# Altium schematic sheet ESP8266EX.SchDoc
size A4
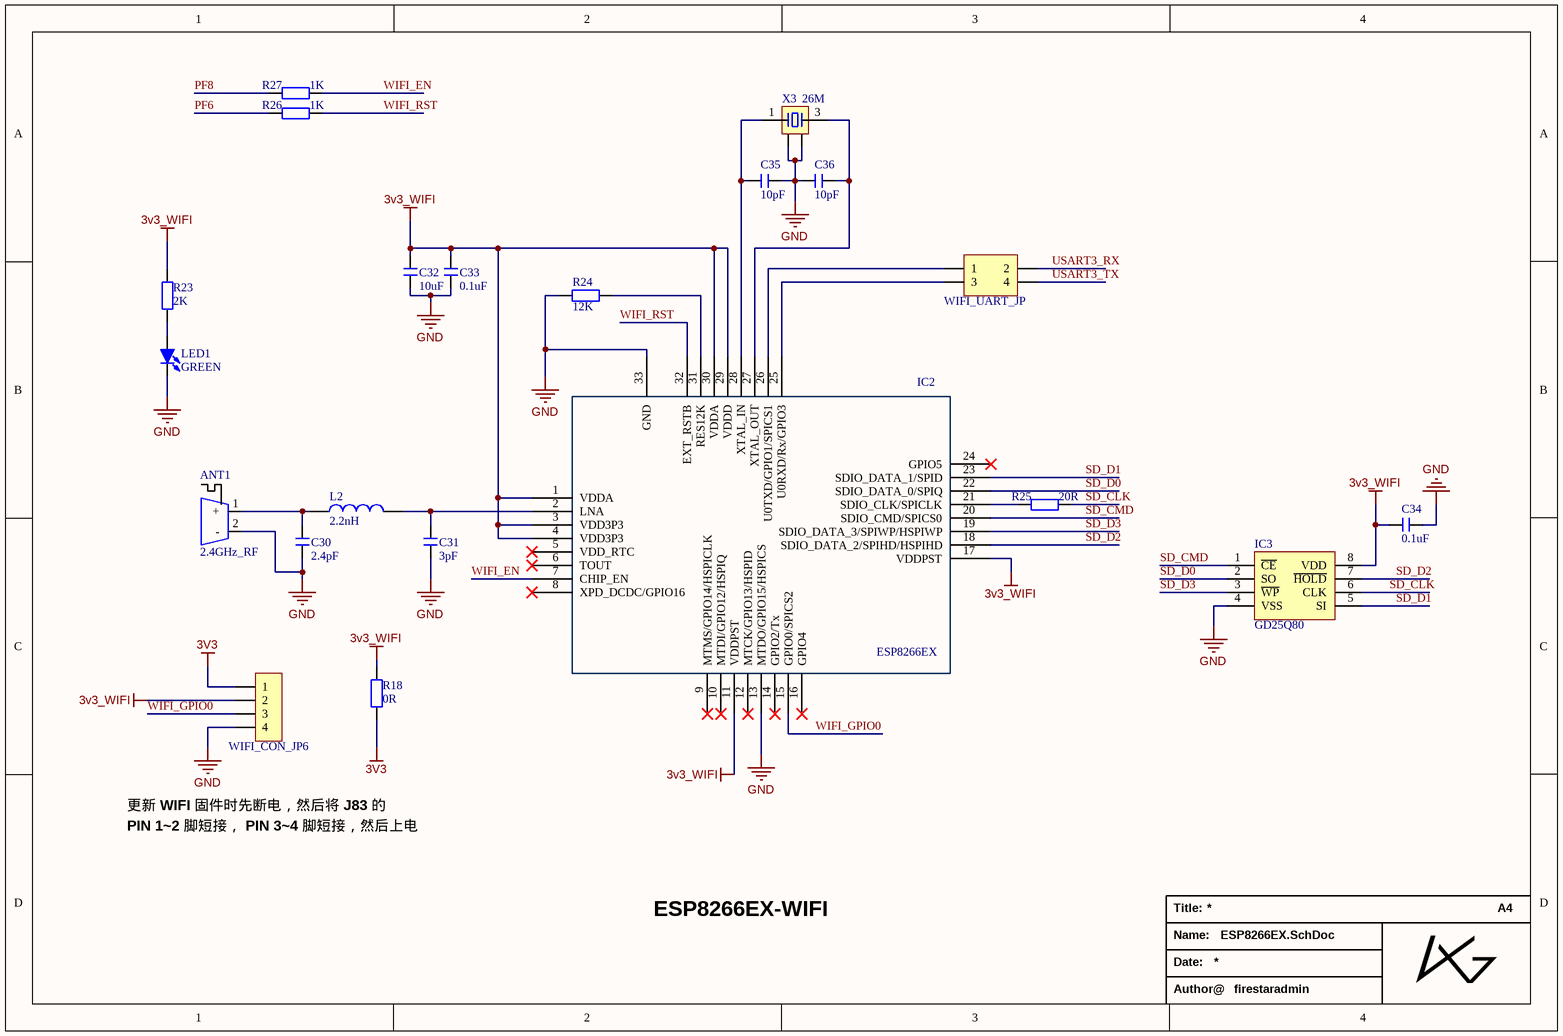
[diagram p0: ESP8266EX.SchDoc]

## Parts
ANT1  2.4GHz_RF  [ANT-F-1-2.4G]
C30  2.4pF  [C 0603_M]
C31  3pF  [C 0603_M]
C32  10uF  [C 0603_M]
C33  0.1uF  [C 0603_M]
C34  0.1uF  [C 0603_M]
C35  10pF  [C 0603_M]
C36  10pF  [C 0603_M]
IC2  ESP8266EX  [QFN32 5x5_L]
IC3  GD25Q80  [SOP8W_N]
L2  2.2nH  [L 0603]
LED1  GREEN  [LED 0603G]
R18  0R  [R 0603_M]
R23  2K  [R 0603_M]
R24  12K  [R 0603_M]
R25  20R  [R 0603_M]
R26  1K  [R 0603_M]
R27  1K  [R 0603_M]
WIFI_CON_JP6  HDR-1X4  [HDR2.54-LI-4P]  (value not drawn)
WIFI_UART_JP  Header2X2  [HDR2.54-LI-2x2P]  (value not drawn)
X3  26M  [OSC 3225-4P]

## Nets
3V3: R18.1 WIFI_CON_JP6.1
3v3_WIFI: C32.1 C33.1 C34.1 IC2.1(VDDA) IC2.3(VDD3P3) IC2.4(VDD3P3) IC2.11(VDDPST) IC2.17(VDDPST) IC2.29(VDDD) IC2.30(VDDA) IC3.8(VDD) R18.2 R23.2 WIFI_CON_JP6.2
GND: ANT1.2(-) C30.2 C31.2 C32.2 C33.2 C34.2 C35.1 C36.2 IC2.13(MTDO/GPIO15/HSPICS) IC2.33(GND) IC3.4(VSS) LED1.2(K) R24.2 WIFI_CON_JP6.4 X3.2 X3.4
PF6: R26.2
PF8: R27.2
SD_CLK: IC3.6(CLK) R25.1
SD_CMD: IC2.20(SDIO_CMD/SPICS0) IC3.1(~{CE})
SD_D0: IC2.22(SDIO_DATA_0/SPIQ) IC3.2(SO)
SD_D1: IC2.23(SDIO_DATA_1/SPID) IC3.5(SI)
SD_D2: IC2.18(SDIO_DATA_2/SPIHD/HSPIHD) IC3.7(~{HOLD})
SD_D3: IC2.19(SDIO_DATA_3/SPIWP/HSPIWP) IC3.3(~{WP})
USART3_RX: WIFI_UART_JP.2
USART3_TX: WIFI_UART_JP.4
WIFI_EN: IC2.7(CHIP_EN) R27.1
WIFI_GPIO0: IC2.15(GPIO0/SPICS2) WIFI_CON_JP6.3
WIFI_RST: IC2.32(EXT_RSTB) R26.1
NetANT1_1: ANT1.1(+) C30.1 L2.1
NetC31_1: C31.1 IC2.2(LNA) L2.2
NetC35_2: C35.2 IC2.28(XTAL_IN) X3.1
NetC36_1: C36.1 IC2.27(XTAL_OUT) X3.3
NetIC2_21: IC2.21(SDIO_CLK/SPICLK) R25.2
NetIC2_25: IC2.25(U0RXD/Rx/GPIO3) WIFI_UART_JP.3
NetIC2_26: IC2.26(U0TXD/GPIO1/SPICS1) WIFI_UART_JP.1
NetIC2_31: IC2.31(RES12K) R24.1
NetLED1_1: LED1.1(A) R23.1

Not connected (* = marked no-connect by the designer): IC2 5(VDD_RTC)* 6(TOUT)* 8(XPD_DCDC/GPIO16)* 9(MTMS/GPIO14/HSPICLK)* 10(MTDI/GPIO12/HSPIQ)* 12(MTCK/GPIO13/HSPID)* 14(GPIO2/Tx)* 16(GPIO4)* 24(GPIO5)*

## Notes on the sheet
- 更新 WIFI 固件时先断电，然后将 J83 的
- PIN 1~2 脚短接， PIN 3~4 脚短接，然后上电
- ESP8266EX-WIFI
- Title:
- A4
- Name:
- Date:
- Author@
- firestaradmin

## Library data of the parts
C30-C36 = C: 无极性贴片电容; 版权归属: 源创客; BOM名称: 无极性贴片电容; 学习资源: www.ooocke.com
IC2 = ESP8266EX: WIFI-芯片; 版权归属: 源创客; BOM名称: WIFI-芯片; 学习资源: www.ooocke.com
IC3 = SST25VFxx: 外置Flash; 版权归属: 源创客; BOM名称: 外置Flash; 学习资源: www.ooocke.com
L2 = L: 小功率贴片电感; 版权归属: 源创客; BOM名称: 小功率贴片电感; 学习资源: www.ooocke.com
LED1 = LED-SMD: 贴片LED; 版权归属: 源创客; BOM名称: 贴片LED; 学习资源: www.ooocke.com
R18 R23-R27 = RES: Resistor
WIFI_CON_JP6 = Header 4: 4P接插件; 版权归属: 源创客; BOM名称: 4P接插件; 学习资源: www.ooocke.com
WIFI_UART_JP = Header 2X2: 2*2P接插件; 版权归属: 源创客; BOM名称: 2*2P接插件; 学习资源: www.ooocke.com
X3 = XTAL-4P: 4脚无源晶振; 版权归属: 源创客; BOM名称: 4脚无源晶振; 学习资源: www.ooocke.com